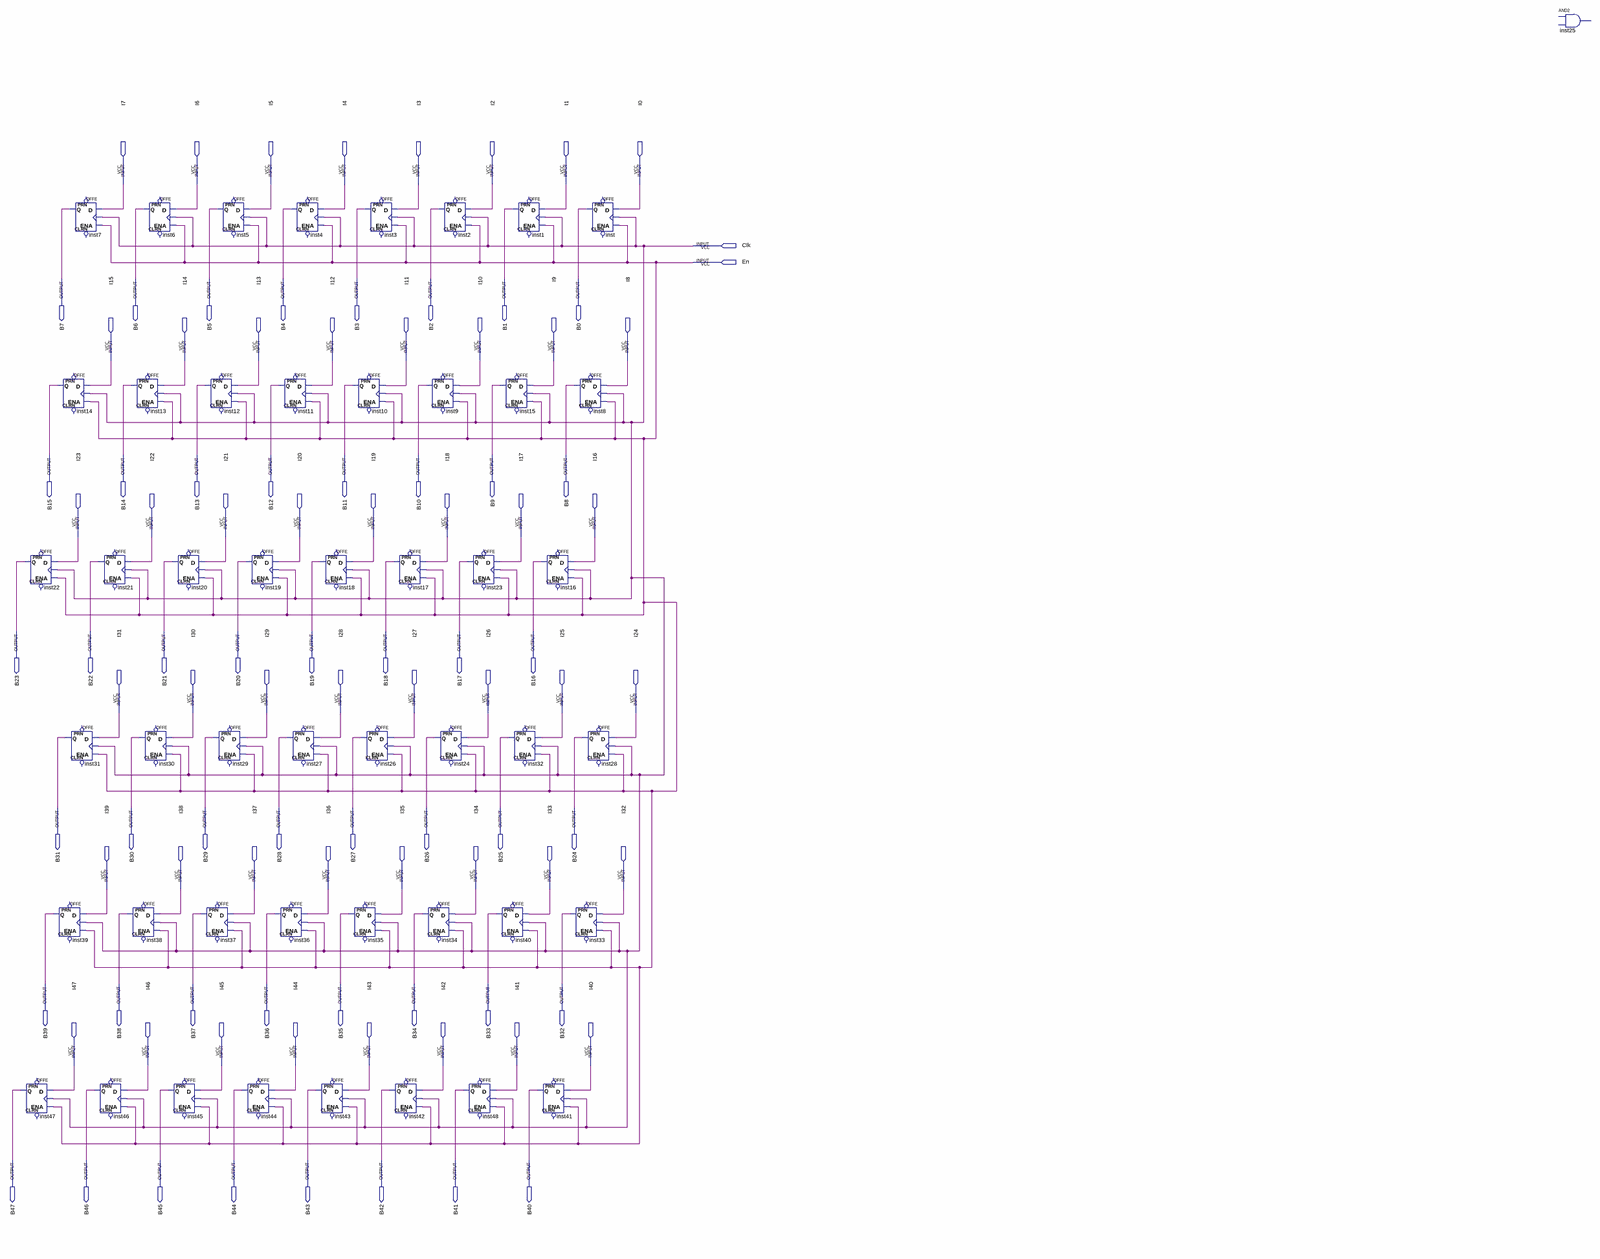
[diagram p0: schematic sheet, whole]
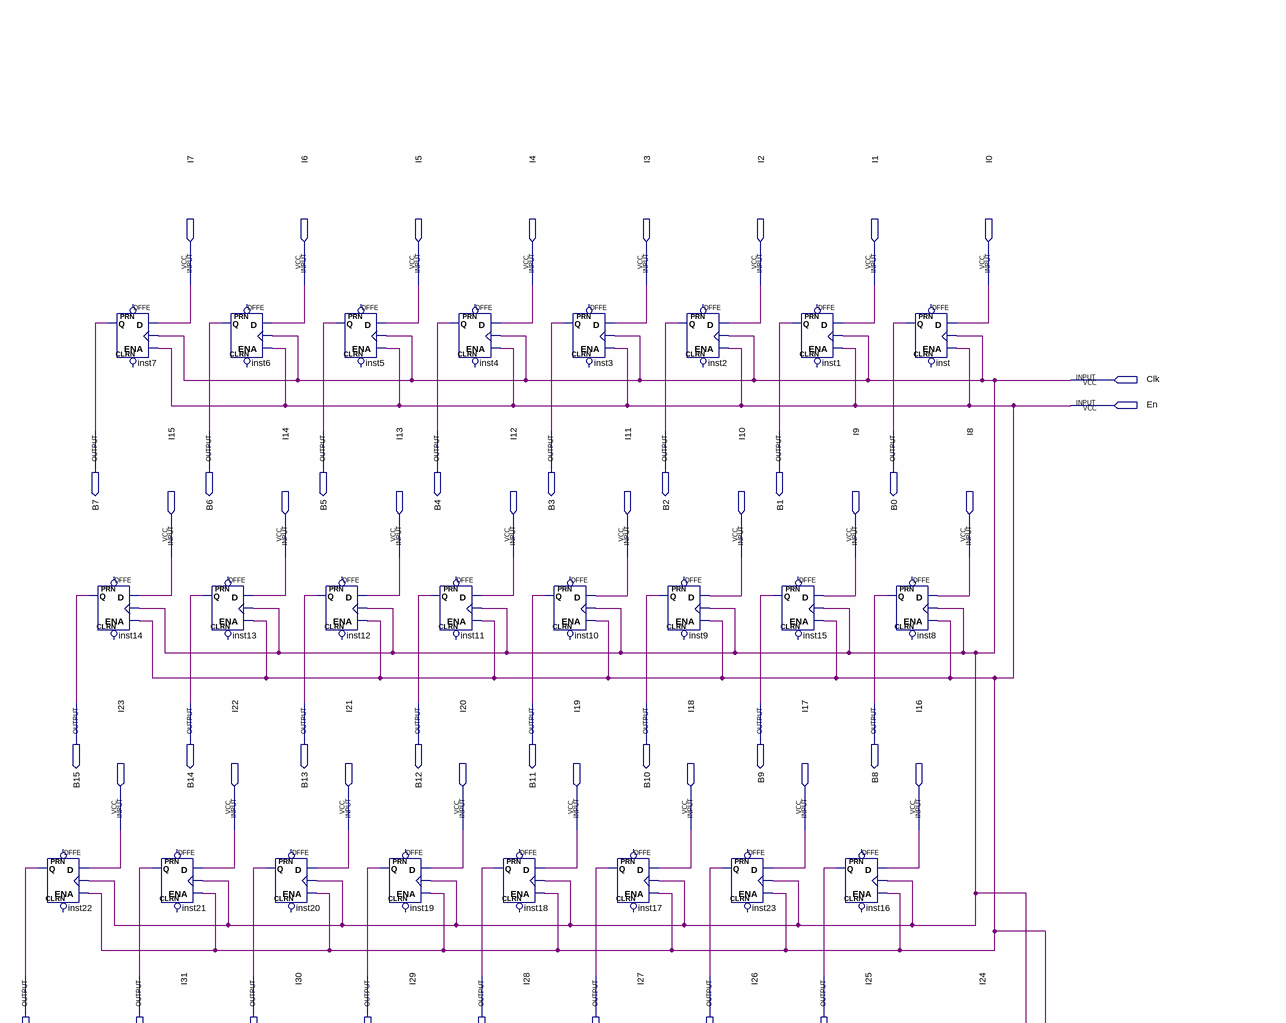
[diagram p1: schematic sheet, upper left part]
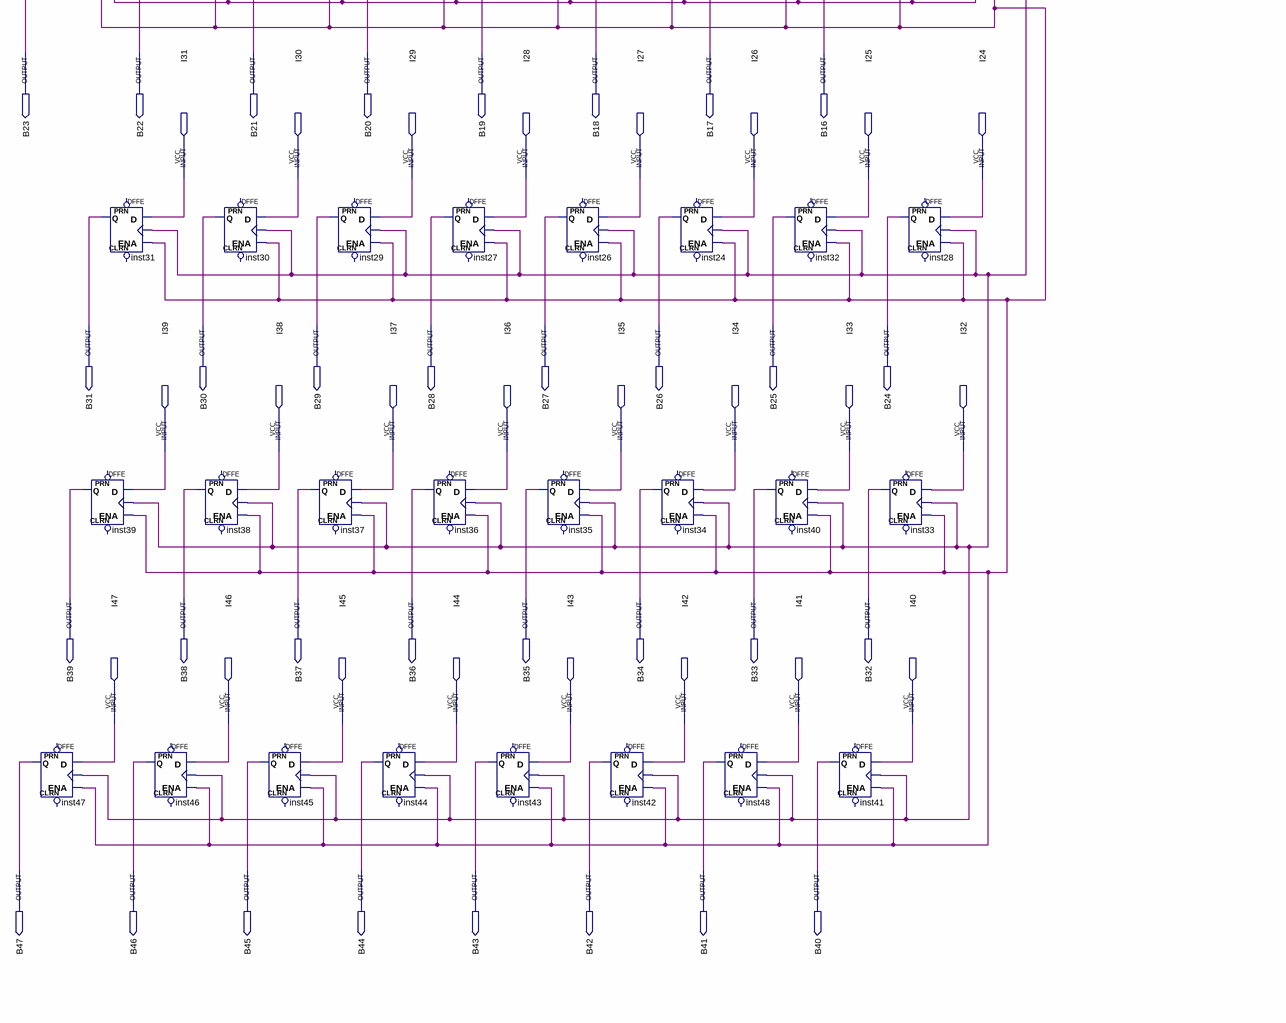
[diagram p2: schematic sheet, lower left part]
// Quartus schematic 48_bit_parallel_reg.bdf as structural Verilog: 49 symbols, 98 pins
module \48_bit_parallel_reg  (
  input  I7,
  input  I6,
  input  I5,
  input  I4,
  input  I3,
  input  I2,
  input  I1,
  input  I0,
  input  Clk,
  input  En,
  input  I15,
  input  I14,
  input  I13,
  input  I12,
  input  I11,
  input  I10,
  input  I9,
  input  I8,
  input  I23,
  input  I22,
  input  I21,
  input  I20,
  input  I19,
  input  I18,
  input  I17,
  input  I16,
  input  I31,
  input  I30,
  input  I29,
  input  I28,
  input  I27,
  input  I26,
  input  I25,
  input  I24,
  input  I39,
  input  I38,
  input  I37,
  input  I36,
  input  I35,
  input  I34,
  input  I33,
  input  I32,
  input  I47,
  input  I46,
  input  I45,
  input  I44,
  input  I43,
  input  I42,
  input  I41,
  input  I40,
  output B7,
  output B6,
  output B5,
  output B4,
  output B3,
  output B2,
  output B1,
  output B0,
  output B15,
  output B14,
  output B13,
  output B12,
  output B11,
  output B10,
  output B9,
  output B8,
  output B23,
  output B22,
  output B21,
  output B20,
  output B19,
  output B18,
  output B17,
  output B16,
  output B31,
  output B30,
  output B29,
  output B28,
  output B27,
  output B26,
  output B25,
  output B24,
  output B39,
  output B38,
  output B37,
  output B36,
  output B35,
  output B34,
  output B33,
  output B32,
  output B47,
  output B46,
  output B45,
  output B44,
  output B43,
  output B42,
  output B41,
  output B40
);

  DFFE inst22 (.D(I23), .CLK(Clk), .ENA(En), .Q(B23));  // open: PRN, CLRN
  DFFE inst47 (.D(I47), .CLK(Clk), .ENA(En), .Q(B47));  // open: PRN, CLRN
  DFFE inst7 (.D(I7), .CLK(Clk), .ENA(En), .Q(B7));  // open: PRN, CLRN
  DFFE inst14 (.D(I15), .CLK(Clk), .ENA(En), .Q(B15));  // open: PRN, CLRN
  DFFE inst31 (.D(I31), .CLK(Clk), .ENA(En), .Q(B31));  // open: PRN, CLRN
  DFFE inst39 (.D(I39), .CLK(Clk), .ENA(En), .Q(B39));  // open: PRN, CLRN
  DFFE inst21 (.D(I22), .CLK(Clk), .ENA(En), .Q(B22));  // open: PRN, CLRN
  DFFE inst46 (.D(I46), .CLK(Clk), .ENA(En), .Q(B46));  // open: PRN, CLRN
  DFFE inst13 (.D(I14), .CLK(Clk), .ENA(En), .Q(B14));  // open: PRN, CLRN
  DFFE inst30 (.D(I30), .CLK(Clk), .ENA(En), .Q(B30));  // open: PRN, CLRN
  DFFE inst38 (.D(I38), .CLK(Clk), .ENA(En), .Q(B38));  // open: PRN, CLRN
  DFFE inst6 (.D(I6), .CLK(Clk), .ENA(En), .Q(B6));  // open: PRN, CLRN
  DFFE inst20 (.D(I21), .CLK(Clk), .ENA(En), .Q(B21));  // open: PRN, CLRN
  DFFE inst45 (.D(I45), .CLK(Clk), .ENA(En), .Q(B45));  // open: PRN, CLRN
  DFFE inst12 (.D(I13), .CLK(Clk), .ENA(En), .Q(B13));  // open: PRN, CLRN
  DFFE inst37 (.D(I37), .CLK(Clk), .ENA(En), .Q(B37));  // open: PRN, CLRN
  DFFE inst5 (.D(I5), .CLK(Clk), .ENA(En), .Q(B5));  // open: PRN, CLRN
  DFFE inst29 (.D(I29), .CLK(Clk), .ENA(En), .Q(B29));  // open: PRN, CLRN
  DFFE inst19 (.D(I20), .CLK(Clk), .ENA(En), .Q(B20));  // open: PRN, CLRN
  DFFE inst44 (.D(I44), .CLK(Clk), .ENA(En), .Q(B44));  // open: PRN, CLRN
  DFFE inst4 (.D(I4), .CLK(Clk), .ENA(En), .Q(B4));  // open: PRN, CLRN
  DFFE inst11 (.D(I12), .CLK(Clk), .ENA(En), .Q(B12));  // open: PRN, CLRN
  DFFE inst27 (.D(I28), .CLK(Clk), .ENA(En), .Q(B28));  // open: PRN, CLRN
  DFFE inst36 (.D(I36), .CLK(Clk), .ENA(En), .Q(B36));  // open: PRN, CLRN
  DFFE inst18 (.D(I19), .CLK(Clk), .ENA(En), .Q(B19));  // open: PRN, CLRN
  DFFE inst43 (.D(I43), .CLK(Clk), .ENA(En), .Q(B43));  // open: PRN, CLRN
  DFFE inst3 (.D(I3), .CLK(Clk), .ENA(En), .Q(B3));  // open: PRN, CLRN
  DFFE inst10 (.D(I11), .CLK(Clk), .ENA(En), .Q(B11));  // open: PRN, CLRN
  DFFE inst26 (.D(I27), .CLK(Clk), .ENA(En), .Q(B27));  // open: PRN, CLRN
  DFFE inst35 (.D(I35), .CLK(Clk), .ENA(En), .Q(B35));  // open: PRN, CLRN
  DFFE inst17 (.D(I18), .CLK(Clk), .ENA(En), .Q(B18));  // open: PRN, CLRN
  DFFE inst42 (.D(I42), .CLK(Clk), .ENA(En), .Q(B42));  // open: PRN, CLRN
  DFFE inst9 (.D(I10), .CLK(Clk), .ENA(En), .Q(B10));  // open: PRN, CLRN
  DFFE inst24 (.D(I26), .CLK(Clk), .ENA(En), .Q(B26));  // open: PRN, CLRN
  DFFE inst34 (.D(I34), .CLK(Clk), .ENA(En), .Q(B34));  // open: PRN, CLRN
  DFFE inst2 (.D(I2), .CLK(Clk), .ENA(En), .Q(B2));  // open: PRN, CLRN
  DFFE inst23 (.D(I17), .CLK(Clk), .ENA(En), .Q(B17));  // open: PRN, CLRN
  DFFE inst48 (.D(I41), .CLK(Clk), .ENA(En), .Q(B41));  // open: PRN, CLRN
  DFFE inst15 (.D(I9), .CLK(Clk), .ENA(En), .Q(B9));  // open: PRN, CLRN
  DFFE inst40 (.D(I33), .CLK(Clk), .ENA(En), .Q(B33));  // open: PRN, CLRN
  DFFE inst1 (.D(I1), .CLK(Clk), .ENA(En), .Q(B1));  // open: PRN, CLRN
  DFFE inst32 (.D(I25), .CLK(Clk), .ENA(En), .Q(B25));  // open: PRN, CLRN
  DFFE inst16 (.D(I16), .CLK(Clk), .ENA(En), .Q(B16));  // open: PRN, CLRN
  DFFE inst41 (.D(I40), .CLK(Clk), .ENA(En), .Q(B40));  // open: PRN, CLRN
  DFFE inst (.D(I0), .CLK(Clk), .ENA(En), .Q(B0));  // open: PRN, CLRN
  DFFE inst8 (.D(I8), .CLK(Clk), .ENA(En), .Q(B8));  // open: PRN, CLRN
  DFFE inst28 (.D(I24), .CLK(Clk), .ENA(En), .Q(B24));  // open: PRN, CLRN
  DFFE inst33 (.D(I32), .CLK(Clk), .ENA(En), .Q(B32));  // open: PRN, CLRN
  // AND2 inst25 is placed but not wired
endmodule
